# EAGLE design piarmedv1 (EAGLE 7.5.0)
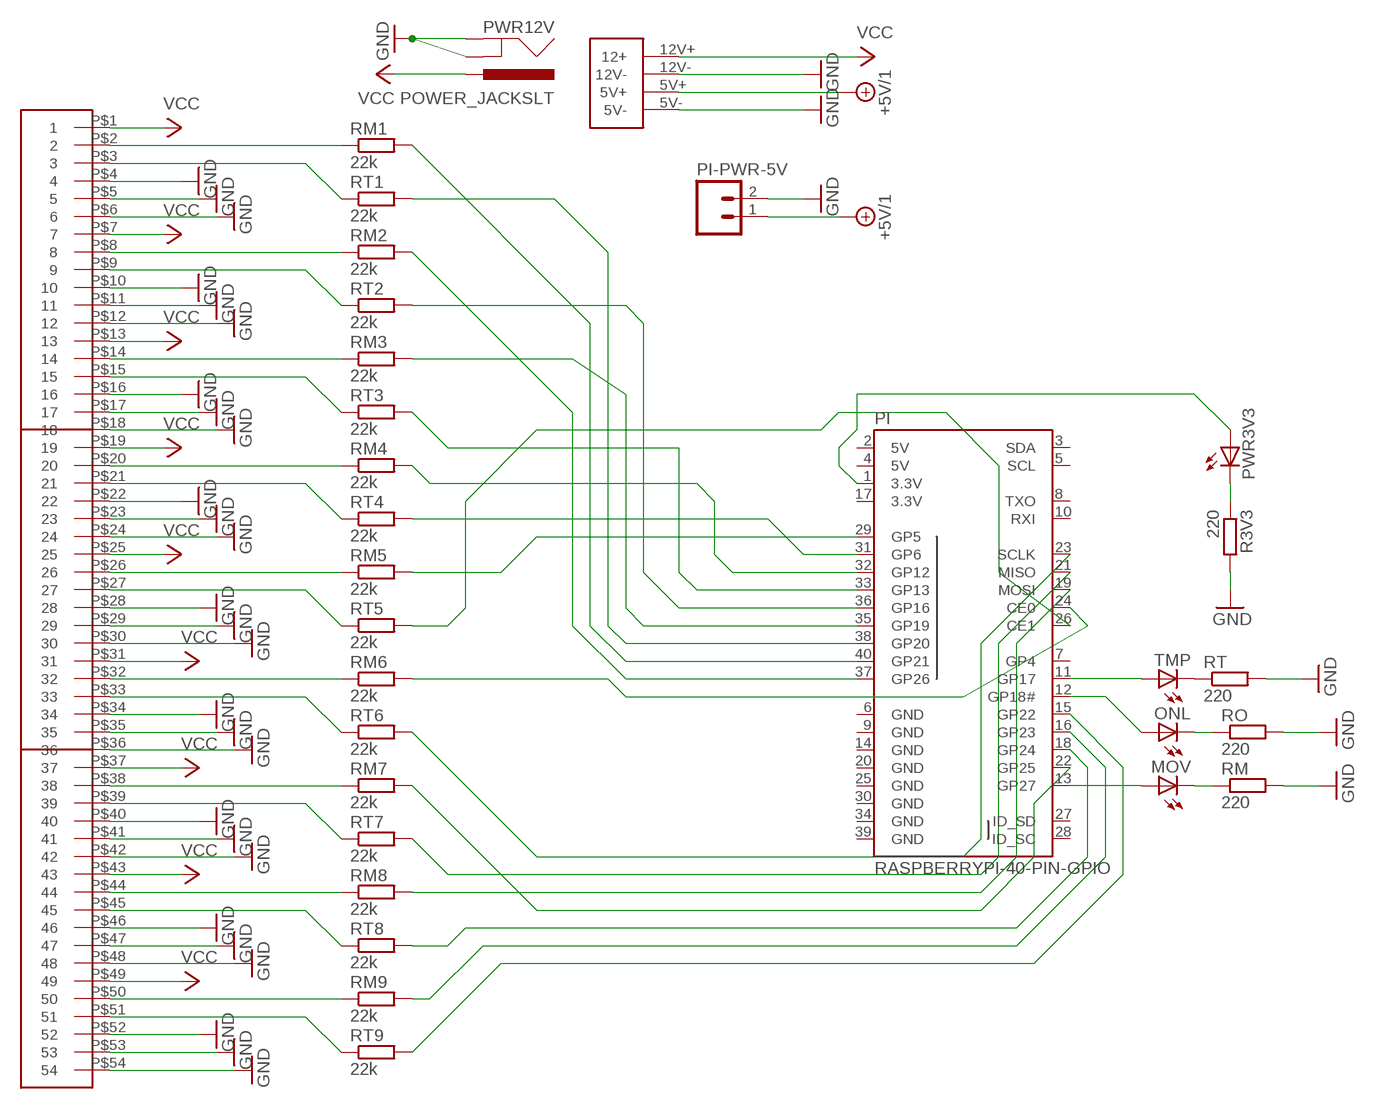
[diagram p0: schematic, sheet 1]

## Parts
MOV  LED3MM  [LED3MM]
ONL  LED3MM  [LED3MM]
PI  RASPBERRYPI-40-PIN-GPIO  [2X20-SHROUDED]
PI-PWR-5V  M02PTH  [1X02]
PWR3V3  LED3MM  [LED3MM]
PWR12V  POWER_JACKSLT  [POWER_JACK_SLOT]
R3V3  220  R-EU_0204/5  [0204/5]
RM  220  R-EU_0204/5  [0204/5]
RM1  22k  R-EU_0204/5  [0204/5]
RM2  22k  R-EU_0204/5  [0204/5]
RM3  22k  R-EU_0204/5  [0204/5]
RM4  22k  R-EU_0204/5  [0204/5]
RM5  22k  R-EU_0204/5  [0204/5]
RM6  22k  R-EU_0204/5  [0204/5]
RM7  22k  R-EU_0204/5  [0204/5]
RM8  22k  R-EU_0204/5  [0204/5]
RM9  22k  R-EU_0204/5  [0204/5]
RO  220  R-EU_0204/5  [0204/5]
RT  220  R-EU_0204/5  [0204/5]
RT1  22k  R-EU_0204/5  [0204/5]
RT2  22k  R-EU_0204/5  [0204/5]
RT3  22k  R-EU_0204/5  [0204/5]
RT4  22k  R-EU_0204/5  [0204/5]
RT5  22k  R-EU_0204/5  [0204/5]
RT6  22k  R-EU_0204/5  [0204/5]
RT7  22k  R-EU_0204/5  [0204/5]
RT8  22k  R-EU_0204/5  [0204/5]
RT9  22k  R-EU_0204/5  [0204/5]
TMP  LED3MM  [LED3MM]
U$1  POWER-12V-5VSTD  [4PIN]
U$2  3X18HEADER  [3X18HEADER]

## Nets
+5V/1: PI-PWR-5V.1 U$1.5V+
GND: PI-PWR-5V.2 PWR12V.GND@1(GNDBREAK) PWR12V.GND@2(GND) R3V3.2 RM.2 RO.2 RT.2 U$1.5V- U$1.12V- U$2.P$4 U$2.P$5 U$2.P$6 U$2.P$10 U$2.P$11 U$2.P$12 U$2.P$16 U$2.P$17 U$2.P$18 U$2.P$22 U$2.P$23 U$2.P$24 U$2.P$28 U$2.P$29 U$2.P$30 U$2.P$34 U$2.P$35 U$2.P$36 U$2.P$40 U$2.P$41 U$2.P$42 U$2.P$46 U$2.P$47 U$2.P$48 U$2.P$52 U$2.P$53 U$2.P$54
N$1: PWR3V3.K(C) R3V3.1
N$2: ONL.K(C) RO.1
N$3: RT.1 TMP.K(C)
N$4: MOV.K(C) RM.1
N$7: ONL.A PI.12(GP18#)
N$8: PI.11(GP17) TMP.A
N$9: MOV.A PI.13(GP27)
N$10: PI.40(GP21) RM1.2
N$11: PI.38(GP20) RT1.2
N$12: PI.37(GP26) RM2.2
N$13: PI.36(GP16) RT2.2
N$14: PI.35(GP19) RM3.2
N$15: PI.33(GP13) RT3.2
N$16: PI.32(GP12) RM4.2
N$18: PI.31(GP6) RT4.2
N$19: PI.29(GP5) RM5.2
N$20: PI.26(CE1) RT5.2
N$21: PI.24(CE0) RM6.2
N$22: PI.23(SCLK) RT6.2
N$23: RM1.1 U$2.P$2
N$24: PI.21(MISO) RT7.2
N$25: PI.19(MOSI) RM8.2
N$26: PI.18(GP24) RT8.2
N$27: PI.16(GP23) RM9.2
N$28: PI.15(GP22) RT9.2
N$29: RT1.1 U$2.P$3
N$30: RM2.1 U$2.P$8
N$31: RT2.1 U$2.P$9
N$32: RM3.1 U$2.P$14
N$33: RT3.1 U$2.P$15
N$34: RM4.1 U$2.P$20
N$35: RT4.1 U$2.P$21
N$36: PI.22(GP25) RM7.2
N$37: RM5.1 U$2.P$26
N$38: RT5.1 U$2.P$27
N$39: RM6.1 U$2.P$32
N$40: RT6.1 U$2.P$33
N$41: RM7.1 U$2.P$38
N$42: RT7.1 U$2.P$39
N$43: RM8.1 U$2.P$44
N$44: RT8.1 U$2.P$45
N$45: RM9.1 U$2.P$50
N$46: RT9.1 U$2.P$51
POWER: PI.1(3.3V) PWR3V3.A
VCC: PWR12V.PWR U$1.12V+(12+) U$2.P$1 U$2.P$7 U$2.P$13 U$2.P$19 U$2.P$25 U$2.P$31 U$2.P$37 U$2.P$43 U$2.P$49
Unconnected: PI.3(SDA) PI.5(SCL) PI.7(GP4) PI.8(TXO) PI.10(RXI) PI.27(ID_SD) PI.28(ID_SC)

## Power pins joined to a net without a drawn wire
3.3V: PI.17(3.3V)
5V: PI.2(5V) PI.4(5V)
GND: PI.6(GND) PI.9(GND) PI.14(GND) PI.20(GND) PI.25(GND) PI.30(GND) PI.34(GND) PI.39(GND)

## Library data of the parts
MOV ONL PWR3V3 TMP = led:LED: LED OSRAM: - CHIPLED LG R971, LG N971, LY N971, LG Q971, LY Q971, LO R971, LY R971 LH N974, LH R974 LS Q976, LO Q976, LY Q976 LO Q996 - Hyper CHIPLED LW Q18S LB Q993, LB Q99A, LB R99A - SideLED LS A670, LO A670, LY A670, LG A670, LP A670 LB A673, LV A673, LT A673, LW A673 LH A674 LY A675 LS A676, LA A676, LO A676, LY A676, LW A676 LS A679, LY A679, LG A679 - Hyper Micro SIDELED® LS Y876, LA Y876, LO Y876, LY Y876 LT Y87S - SmartLED LW L88C, LW L88S LB L89C, LB L89S, LG L890 LS L89K, LO L89K, LY L89K LS L896, LA L896, LO L896, LY L896 - TOPLED LS T670, LO T670, LY T670, LG T670, LP T670 LSG T670, LSP T670, LSY T670, LOP T670, LYG T670 LG T671, LOG T671, LSG T671 LB T673, LV T673, LT T673, LW T673 LH T674 LS T676, LA T676, LO T676, LY T676, LB T676, LH T676, LSB T676, LW T676 LB T67C, LV T67C, LT T67C, LS T67K, LO T67K, LY T67K, LW E67C LS E67B, LA E67B, LO E67B, LY E67B, LB E67C, LV E67C, LT E67C LW T67C LS T679, LY T679, LG T679 LS T770, LO T770, LY T770, LG T770, LP T770 LB T773, LV T773, LT T773, LW T773 LH T774 LS E675, LA E675, LY E675, LS T675 LS T776, LA T776, LO T776, LY T776, LB T776 LHGB T686 LT T68C, LB T68C - Hyper Mini TOPLED® LB M676 - Mini TOPLED Santana® LG M470 LS M47K, LO M47K, LY M47K Source: http://www.osram.convergy.de LUXEON: - LUMILED® LXK2-PW12-R00, LXK2-PW12-S00, LXK2-PW14-U00, LXK2-PW14-V00 LXK2-PM12-R00, LXK2-PM12-S00, LXK2-PM14-U00 LXK2-PE12-Q00, LXK2-PE12-R00, LXK2-PE12-S00, LXK2-PE14-T00, LXK2-PE14-U00 LXK2-PB12-K00, LXK2-PB12-L00, LXK2-PB12-M00, LXK2-PB14-N00, LXK2-PB14-P00, LXK2-PB14-Q00 LXK2-PR12-L00, LXK2-PR12-M00, LXK2-PR14-Q00, LXK2-PR14-R00 LXK2-PD12-Q00, LXK2-PD12-R00, LXK2-PD12-S00 LXK2-PH12-R00, LXK2-PH12-S00 LXK2-PL12-P00, LXK2-PL12-Q00, LXK2-PL12-R00 Source: www.luxeon.com KINGBRIGHT: KA-3528ASYC Source: www.kingbright.com
PI = SparkFun-Boards:RASPBERRYPI-40-PIN-GPIO: Second Generation Raspberry Pi GPIO Header 2x20 pin connector, as found on B, B+, A+ models.
PI-PWR-5V = SparkFun-Connectors:M02: Standard 2-pin 0.1" header. Use with - straight break away headers ( PRT-00116) - right angle break away headers (PRT-00553) - swiss pins (PRT-00743) - machine pins (PRT-00117) - female headers (PRT-00115) Molex polarized connector foot print use with: PRT-08233 with associated crimp pins and housings. 2.54_SCREWTERM for use with PRT-10571. 3.5mm Screw Terminal footprints for PRT-08084 5mm Screw Terminal footprints for use with PRT-08432
PWR12V = SparkFun-Connectors:POWER_JACK: Power Jack This is the standard 5.5mm barrel jack for power. The PTH is the most common, proven, reliable, footprint. The Slot footprint only works if the mill layer is transmitted to the PCB fab house so be warned. Mating wall wart : TOL-00298 (and others); PROD_ID: PRT-00119
R3V3 RM RM1-RM9 RO RT RT1-RT9 = rcl:R-EU_: RESISTOR, European symbol
U$1 = piarmed:POWER-12V-5V: Buck Converter 12V-5V
U$2 = piarmed:3X18HEADER: 3x18 header @ 2.54mm apart

## Board
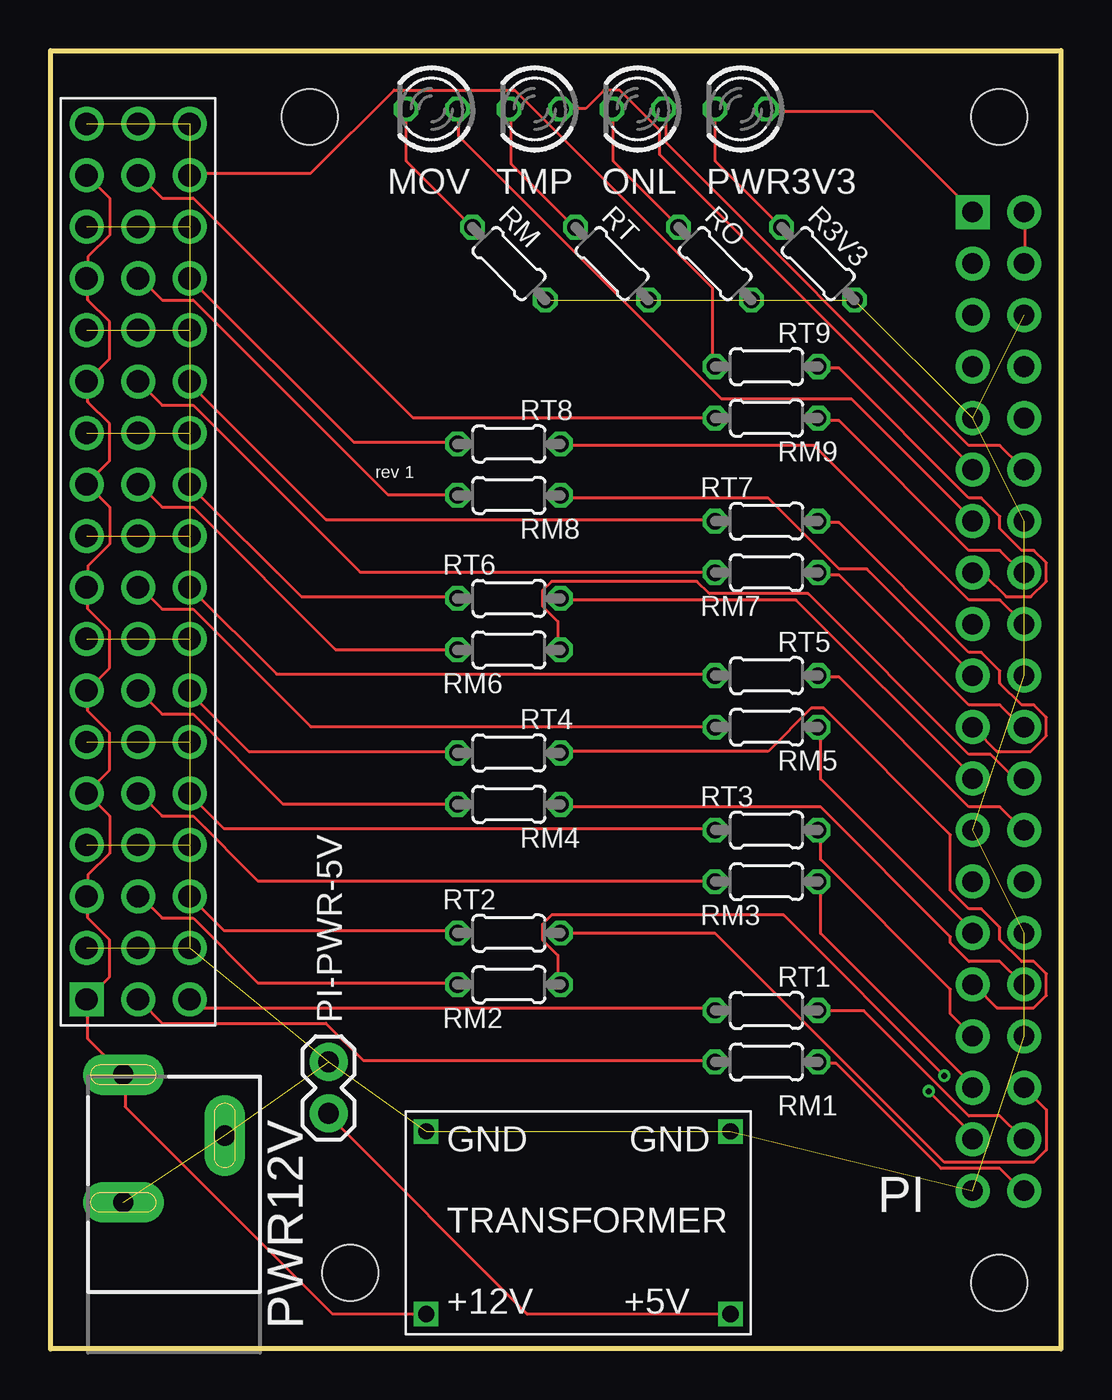
[diagram p1: board, top side]
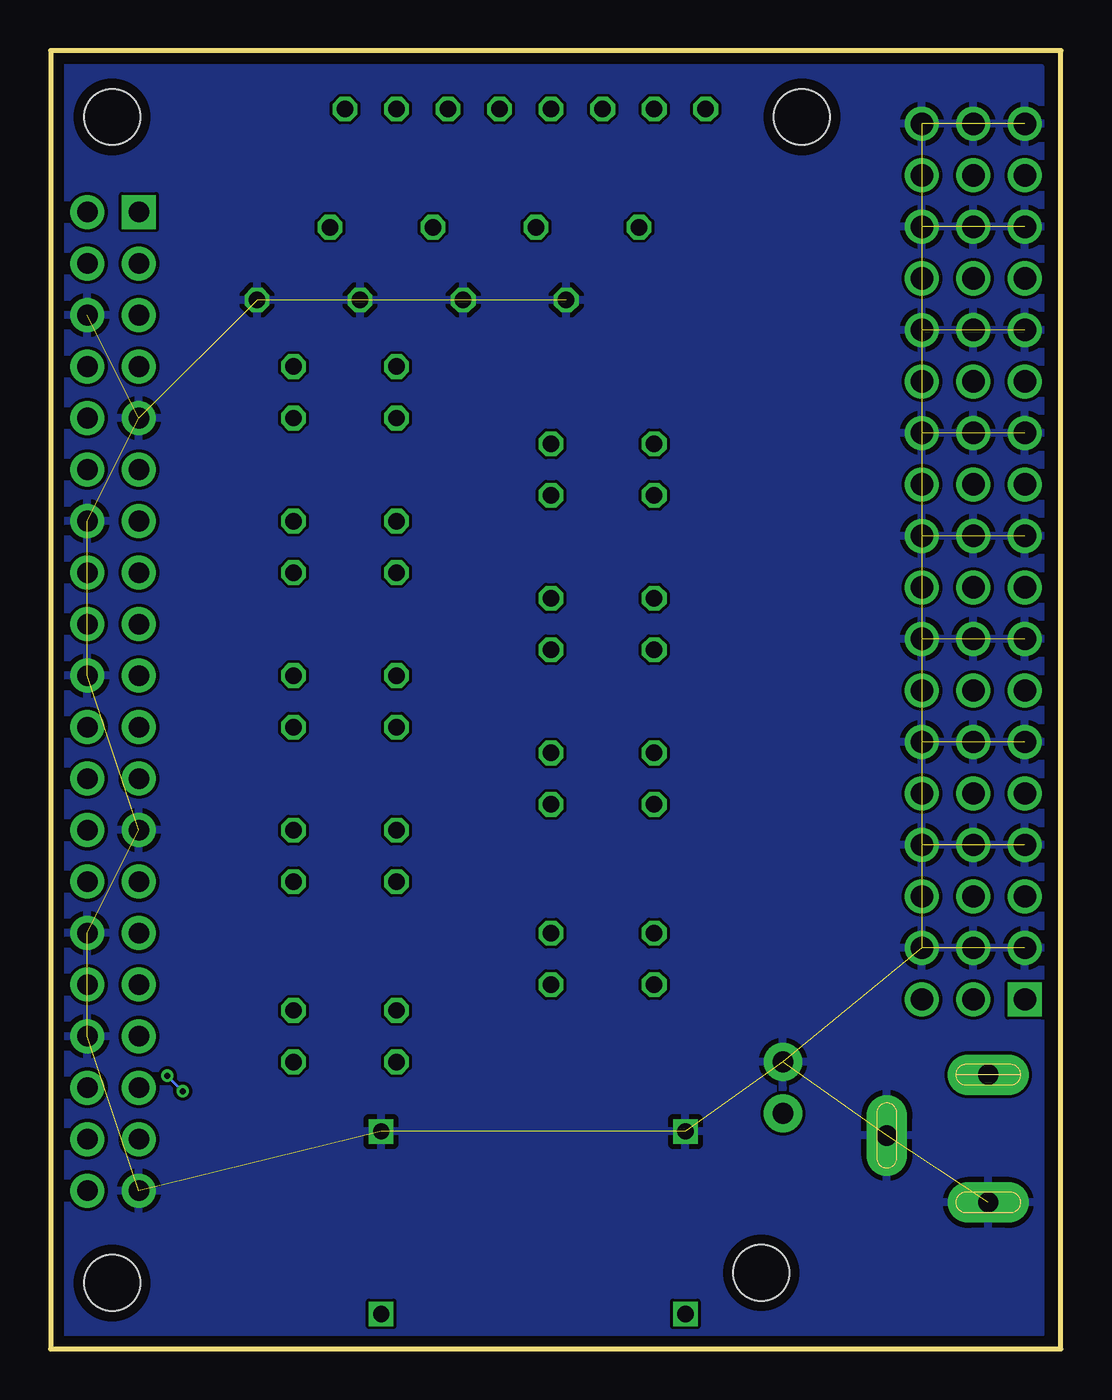
[diagram p2: board, bottom side, seen from below]

Size 49.8 x 64.02 mm. Coordinates in mm from the lower left corner, seen from the top.
Outline: 0,64.02 49.8,64.02 49.8,0 0,0 0,64.02
Copper layers (1*16): Top 0.035mm / dielectric 1.6mm / Bottom 0.035mm
Design rules "Elecrow_2-layer_PCB_eagle_rule": minimum track width 6mil, minimum drill 12mil, track to track 6mil, track to pad 6mil, pad to pad 6mil, via to via 8mil, smd to smd 0mil, copper to edge 20mil, drill to drill 10mil, minimum pad ring 6mil, minimum via ring 6mil, stop-mask expansion 0mil, vias tented up to drill 100mil, thermal gap 10mil
Holes 2.75 mm at 46.77,60.75 46.77,3.25 14.77,3.75 12.77,60.75

### Footprints (pad centres in the part's own frame; a part is rotated, then mirrored left to right if it is on the bottom)
LED3MM = drill 0.813 octagon: A -1.27,0; K 1.27,0
2X20-SHROUDED = drill 1.016 pad 1.676 square: 1 -1.27,24.13 | drill 1.016 pad 1.676: 2 1.27,24.13; 3 -1.27,21.59; 4 1.27,21.59; 5 -1.27,19.05; 6 1.27,19.05; 7 -1.27,16.51; 8 1.27,16.51; 9 -1.27,13.97; 10 1.27,13.97; 11 -1.27,11.43; 12 1.27,11.43; 13 -1.27,8.89; 14 1.27,8.89; 15 -1.27,6.35; 16 1.27,6.35; 17 -1.27,3.81; 18 1.27,3.81; 19 -1.27,1.27; 20 1.27,1.27; 21 -1.27,-1.27; 22 1.27,-1.27; 23 -1.27,-3.81; 24 1.27,-3.81; 25 -1.27,-6.35; 26 1.27,-6.35; 27 -1.27,-8.89; 28 1.27,-8.89; 29 -1.27,-11.43; 30 1.27,-11.43; 31 -1.27,-13.97; 32 1.27,-13.97; 33 -1.27,-16.51; 34 1.27,-16.51; 35 -1.27,-19.05; 36 1.27,-19.05; 37 -1.27,-21.59; 38 1.27,-21.59; 39 -1.27,-24.13; 40 1.27,-24.13
1X02 = drill 1.016 pad 1.88: 1 0,0; 2 2.54,0
POWER_JACK_SLOT = drill 1 pad 2 long: GND@1 2.58,7.5; GND@2 7.58,10.8; PWR 2.58,13.8
0204/5 = drill 0.813 octagon: 1 -2.54,0; 2 2.54,0
4PIN = drill 0.8 square: 5V+ 16,1; 5V- 16,10; 12V+ 1,1; 12V- 1,10
3X18HEADER = drill 1.1 pad 1.676 square: P$1 0,0 | drill 1.1 pad 1.676: P$2 2.54,0; P$3 5.08,0; P$4 0,2.54; P$5 2.54,2.54; P$6 5.08,2.54; P$7 0,5.08; P$8 2.54,5.08; P$9 5.08,5.08; P$10 0,7.62; P$11 2.54,7.62; P$12 5.08,7.62; P$13 0,10.16; P$14 2.54,10.16; P$15 5.08,10.16; P$16 0,12.7; P$17 2.54,12.7; P$18 5.08,12.7; P$19 0,15.24; P$20 2.54,15.24; P$21 5.08,15.24; P$22 0,17.78; P$23 2.54,17.78; P$24 5.08,17.78; P$25 0,20.32; P$26 2.54,20.32; P$27 5.08,20.32; P$28 0,22.86; P$29 2.54,22.86; P$30 5.08,22.86; P$31 0,25.4; P$32 2.54,25.4; P$33 5.08,25.4; P$34 0,27.94; P$35 2.54,27.94; P$36 5.08,27.94; P$37 0,30.48; P$38 2.54,30.48; P$39 5.08,30.48; P$40 0,33.02; P$41 2.54,33.02; P$42 5.08,33.02; P$43 0,35.56; P$44 2.54,35.56; P$45 5.08,35.56; P$46 0,38.1; P$47 2.54,38.1; P$48 5.08,38.1; P$49 0,40.64; P$50 2.54,40.64; P$51 5.08,40.64; P$52 0,43.18; P$53 2.54,43.18; P$54 5.08,43.18

### Placement (x,y rotation side)
MOV  18.78,61.14 180 top
ONL  28.94,61.14 180 top
PI  46.72,31.93 0 top
PI-PWR-5V  13.7,11.61 90 top
PWR3V3  34.02,61.14 180 top
PWR12V  1,-0.28 0 top
R3V3  37.83,53.52 315 top
RM  22.59,53.52 315 top
RM1  35.29,14.15 0 top
RM2  22.59,17.96 0 top
RM3  35.29,23.04 0 top
RM4  22.59,26.85 0 top
RM5  35.29,30.66 0 top
RM6  22.59,34.47 0 top
RM7  35.29,38.28 0 top
RM8  22.59,42.09 0 top
RM9  35.29,45.9 0 top
RO  32.75,53.52 315 top
RT  27.67,53.52 315 top
RT1  35.29,16.69 0 top
RT2  22.59,20.5 0 top
RT3  35.29,25.58 0 top
RT4  22.59,29.39 0 top
RT5  35.29,33.2 0 top
RT6  22.59,37.01 0 top
RT7  35.29,40.82 0 top
RT8  22.59,44.63 0 top
RT9  35.29,48.44 0 top
TMP  23.86,61.14 180 top
U$1  17.51,0.72 0 top
U$2  1.77,17.23 0 top
U$3  [719DPILOGO]  8.39,42.93 0 top

### Tracks (layer width: path | path; a pad name or v marks a point on that pad's centre or on a via)
5V
  Top 0.152: PI.4 48.01,53.55 48.01,55.99 PI.2
+5V/1
  Top 0.152: U$1.5V+ 33.38,1.73 23.48,1.73 13.72,11.48 PI-PWR-5V.1
GND  (43 unrouted)
  pour Bottom: 1,0.74 1,63.18 49.26,63.18 49.26,0.74
N$1
  Top 0.152: PWR3V3.K 32.77,61.02 32.77,58.58 35.97,55.38 R3V3.1
N$2
  Top 0.152: ONL.K 27.75,61.02 27.75,58.58 30.95,55.38 RO.1
N$3
  Top 0.152: TMP.K 22.72,61.02 22.72,58.42 25.76,55.38 RT.1
N$4
  Top 0.152: MOV.K 17.53,61.02 17.53,58.58 20.73,55.38 RM.1
N$7
  Top 0.152: ONL.A 30.34,61.02 30.34,59.49 45.27,44.56 46.8,44.56 47.86,43.49 PI.12
N$8
  Top 0.152: TMP.A 25.15,61.17 26.37,61.17 27.29,62.08 28.05,62.08 30.03,60.1 30.03,58.88 45.42,43.49 PI.11
N$9
  Top 0.152: MOV.A 20.12,61.02 20.12,59.8 33.08,46.84 39.48,46.84 45.42,40.9 PI.13
N$10
  Top 0.152: RM1.2 37.96,14.08 38.72,14.08 43.9,8.89 46.8,8.89 47.86,7.83 PI.40
N$11
  Top 0.152: RT1.2 37.96,16.67 40.09,16.67 45.27,11.48 46.8,11.48 47.86,10.42 PI.38
N$12  (via drill 0.3)
  Top 0.152: v44.05,13.47 36.13,21.39 24.7,21.39 24.24,20.93 24.24,20.17 25,19.41 25,18.04 RM2.2 | v43.29,12.7 45.58,10.42 PI.37
  Bottom 0.152: v43.29,12.7 v44.05,13.47
N$13
  Top 0.152: RT2.2 25.15,20.48 32.77,20.48 44.05,9.2 48.47,9.2 49.08,9.81 49.08,11.79 48.01,12.86 PI.36
N$14
  Top 0.152: RM3.2 37.96,22.91 37.96,20.48 45.42,13.01 PI.35
N$15
  Top 0.152: RT3.2 37.96,25.51 37.96,24.13 44.36,17.73 44.36,16.51 45.42,15.45 PI.33
N$16
  Top 0.152: RM4.2 25.15,26.73 37.96,26.73 44.36,20.32 44.36,20.02 45.27,19.11 46.8,19.11 47.86,18.04 PI.32
N$18
  Top 0.152: RT4.2 25.15,29.47 35.37,29.47 37.5,31.6 38.11,31.6 44.36,25.35 44.36,22.61 45.27,21.7 45.88,21.7 46.8,20.78 46.8,20.17 47.86,19.11 48.47,19.11 49.08,18.5 49.08,17.43 48.47,16.82 46.64,16.82 45.58,17.89 PI.31
N$19
  Top 0.152: RM5.2 37.96,30.54 37.96,28.1 45.42,20.63 PI.29
N$20
  Top 0.152: RT5.2 37.96,33.13 38.87,33.13 45.27,26.73 46.8,26.73 47.86,25.66 PI.26
N$21
  Top 0.152: RM6.2 25,34.5 25,35.87 24.24,36.63 24.24,37.39 24.7,37.85 31.86,37.85 32.47,37.24 37.35,37.24 45.27,29.32 46.34,29.32 47.4,28.25 47.86,28.25 PI.24
N$22
  Top 0.152: RT6.2 25.15,36.94 36.74,36.94 45.42,28.25 PI.23
N$23
  Top 0.152: RM1.1 32.62,14.23 15.4,14.23 13.57,16.06 5.49,16.06 4.43,17.12 U$2.P$2
N$24
  Top 0.152: RT7.2 37.96,40.75 38.87,40.75 45.27,34.34 45.88,34.34 46.8,33.43 46.8,32.82 47.86,31.75 48.47,31.75 49.08,31.14 49.08,30.23 48.32,29.47 46.64,29.47 45.58,30.54 PI.21
N$25
  Top 0.152: RM8.2 25.15,41.97 35.37,41.97 38.87,38.46 40.24,38.46 45.42,33.28 PI.19
N$26
  Top 0.152: RT8.2 25.15,44.56 37.65,44.56 45.27,36.94 46.8,36.94 47.86,35.87 PI.18
N$27
  Top 0.152: RM9.2 37.96,45.77 38.87,45.77 45.27,39.37 46.8,39.37 47.86,38.31 PI.16
N$28
  Top 0.152: RT9.2 37.96,48.37 38.87,48.37 45.27,41.97 45.88,41.97 46.8,41.05 46.8,40.44 47.86,39.37 48.47,39.37 49.08,38.76 49.08,37.85 48.32,37.09 47.1,37.09 46.03,38.16 45.58,38.16 PI.15
N$29
  Top 0.152: RT1.1 32.62,16.82 7.17,16.82 6.87,17.12 U$2.P$3
N$30
  Top 0.152: RM2.1 19.97,18.04 10.22,18.04 7.02,21.24 5.49,21.24 4.43,22.3 U$2.P$8
N$31
  Top 0.152: RT2.1 19.97,20.63 8.54,20.63 6.87,22.3 U$2.P$9
N$32
  Top 0.152: RM3.1 32.62,23.07 10.22,23.07 7.02,26.27 5.49,26.27 4.43,27.33 U$2.P$14
N$33
  Top 0.152: RT3.1 32.62,25.66 8.54,25.66 6.87,27.33 U$2.P$15
N$34
  Top 0.152: RM4.1 19.97,26.88 11.44,26.88 7.02,31.3 5.49,31.3 4.43,32.36 U$2.P$20
N$35
  Top 0.152: RT4.1 19.97,29.47 9.76,29.47 6.87,32.36 U$2.P$21
N$36
  Top 0.152: RM7.2 37.96,38.16 38.87,38.16 45.27,31.75 46.8,31.75 47.86,30.69 PI.22
N$37
  Top 0.152: RM5.1 32.62,30.69 12.81,30.69 7.02,36.48 5.49,36.48 4.43,37.55 U$2.P$26
N$38
  Top 0.152: RT5.1 32.62,33.28 11.13,33.28 6.87,37.55 U$2.P$27
N$39
  Top 0.152: RM6.1 19.97,34.5 14.03,34.5 7.02,41.51 5.49,41.51 4.43,42.57 U$2.P$32
N$40
  Top 0.152: RT6.1 19.97,37.09 12.35,37.09 6.87,42.57 U$2.P$33
N$41
  Top 0.152: RM7.1 32.62,38.31 15.25,38.31 7.02,46.54 5.49,46.54 4.43,47.6 U$2.P$38
N$42
  Top 0.152: RT7.1 32.62,40.9 13.57,40.9 6.87,47.6 U$2.P$39
N$43
  Top 0.152: RM8.1 19.97,42.12 16.62,42.12 7.02,51.72 5.49,51.72 4.43,52.78 U$2.P$44
N$44
  Top 0.152: RT8.1 19.97,44.71 14.94,44.71 6.87,52.78 U$2.P$45
N$45
  Top 0.152: RM9.1 32.62,45.93 17.84,45.93 7.02,56.75 5.49,56.75 4.43,57.81 U$2.P$50
N$46
  Top 0.152: RT9.1 32.62,48.52 32.62,52.33 22.87,62.08 16.92,62.08 12.81,57.97 6.87,57.97 U$2.P$51
POWER
  Top 0.152: PWR3V3.A 35.37,61.02 40.55,61.02 45.42,56.14 PI.1
VCC
  Top 0.152: U$2.P$49 1.84,57.81 2.9,56.75 2.9,54.92 1.84,53.85 1.84,52.94 U$2.P$43 1.84,52.78 1.84,51.72 2.9,50.65 2.9,48.82 1.84,47.76 U$2.P$37 1.84,47.6 1.84,46.69 2.9,45.62 2.9,43.79 1.84,42.73 U$2.P$31 1.84,42.57 2.9,41.51 2.9,39.68 1.84,38.61 1.84,37.7 U$2.P$25 1.84,37.55 1.84,36.48 2.9,35.41 2.9,33.58 1.84,32.52 U$2.P$19 1.84,32.36 1.84,31.45 2.9,30.38 2.9,28.55 1.84,27.49 U$2.P$13 1.84,27.33 2.9,26.27 2.9,24.44 1.84,23.37 1.84,22.46 U$2.P$7 1.84,22.3 1.84,21.24 2.9,20.17 2.9,18.34 1.84,17.28 U$2.P$1 1.84,17.12 1.84,15.29 3.51,13.62 PWR12V.PWR 3.67,13.47 3.67,11.94 13.88,1.73 18.45,1.73 U$1.12V+

### Text on the board
tNames: rev 1 | PI